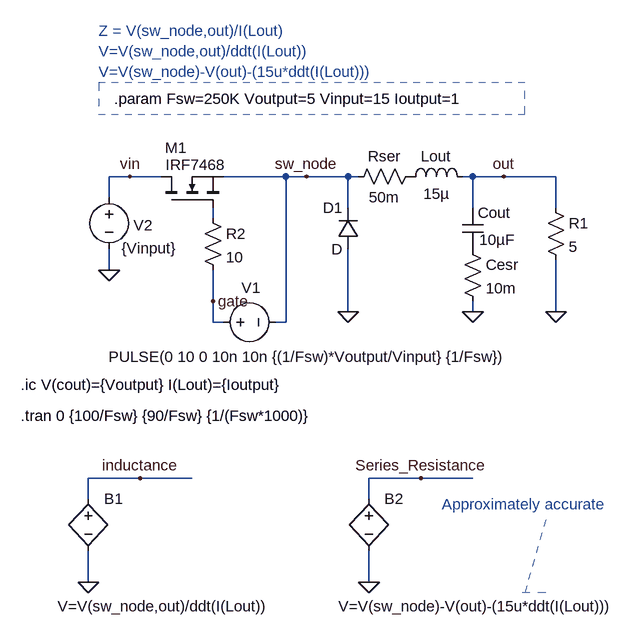
[diagram p0: schematic 03-inductance_volt_div_current.asc]
03-inductance_volt_div_current.asc, the LTspice schematic file:
Version 4
SHEET 1 1132 1048
WIRE -240 48 -272 48
WIRE -192 48 -240 48
WIRE 0 48 -96 48
WIRE 32 48 0 48
WIRE 96 48 32 48
WIRE 112 48 96 48
WIRE 288 48 272 48
WIRE 336 48 288 48
WIRE 416 48 336 48
WIRE -272 80 -272 48
WIRE 96 96 96 48
WIRE 288 96 288 48
WIRE 416 96 416 48
WIRE -112 112 -112 96
WIRE -272 192 -272 160
WIRE -112 240 -112 192
WIRE 96 256 96 160
WIRE 288 256 288 240
WIRE 416 256 416 176
WIRE -112 272 -112 240
WIRE -96 272 -112 272
WIRE 0 272 0 48
WIRE 0 272 -16 272
WIRE -224 512 -304 512
WIRE -144 512 -224 512
WIRE 208 512 128 512
WIRE 288 512 208 512
WIRE -304 544 -304 512
WIRE 128 544 128 512
WIRE -304 672 -304 624
WIRE 128 672 128 624
FLAG 96 256 0
FLAG 288 256 0
FLAG 416 256 0
FLAG 32 48 sw_node
FLAG -112 240 gate
FLAG -272 192 0
FLAG -240 48 vin
FLAG 336 48 out
FLAG -304 672 0
FLAG -224 512 inductance
FLAG 128 672 0
FLAG 208 512 Series_Resistance
SYMBOL ind 176 64 R270
WINDOW 0 32 56 VTop 2
WINDOW 3 5 56 VBottom 2
SYMATTR InstName Lout
SYMATTR Value 15µ
SYMBOL diode 112 160 R180
WINDOW 0 24 64 Left 2
WINDOW 3 24 0 Left 2
SYMATTR InstName D1
SYMBOL cap 272 96 R0
WINDOW 3 26 49 Left 2
SYMATTR Value 10µF
SYMATTR InstName Cout
SYMBOL res 272 144 R0
SYMATTR InstName Cesr
SYMATTR Value 10m
SYMBOL res 400 80 R0
SYMATTR InstName R1
SYMATTR Value 5
SYMBOL voltage -112 272 R270
WINDOW 0 53 44 VRight 2
WINDOW 3 -53 -161 VRight 2
WINDOW 123 0 0 Left 0
WINDOW 39 0 0 Left 0
SYMATTR InstName V1
SYMATTR Value PULSE(0 10 0 10n 10n {(1/Fsw)*Voutput/Vinput} {1/Fsw})
SYMBOL res -128 96 R0
SYMATTR InstName R2
SYMATTR Value 10
SYMBOL voltage -272 64 R0
WINDOW 123 21 95 Left 2
WINDOW 39 0 0 Left 0
WINDOW 0 38 59 Left 2
WINDOW 3 19 94 Left 2
SYMATTR InstName V2
SYMATTR Value {Vinput}
SYMBOL nmos -192 96 R270
WINDOW 0 92 6 VRight 2
WINDOW 3 66 7 VRight 2
SYMATTR InstName M1
SYMATTR Value IRF7468
SYMBOL res 208 32 R90
WINDOW 0 0 56 VBottom 2
WINDOW 3 32 56 VTop 2
SYMATTR InstName Rser
SYMATTR Value 50m
SYMBOL bv -304 528 R0
WINDOW 3 -47 181 Left 2
SYMATTR InstName B1
SYMATTR Value V=V(sw_node,out)/ddt(I(Lout))
SYMBOL bv 128 528 R0
WINDOW 3 -47 181 Left 2
SYMATTR InstName B2
SYMATTR Value V=V(sw_node)-V(out)-(15u*ddt(I(Lout)))
TEXT -264 -72 Left 2 !.param Fsw=250K Voutput=5 Vinput=15 Ioutput=1
TEXT -408 368 Left 2 !.ic V(cout)={Voutput} I(Lout)={Ioutput}
TEXT -408 416 Left 2 !.tran 0 {100/Fsw} {90/Fsw} {1/(Fsw*1000)}
TEXT -288 -176 Left 2 ;Z = V(sw_node,out)/I(Lout)\nV=V(sw_node,out)/ddt(I(Lout))\nV=V(sw_node)-V(out)-(15u*ddt(I(Lout)))
TEXT 240 552 Left 2 ;Approximately accurate
LINE Normal 400 688 352 688 2
LINE Normal 400 576 368 688 2
RECTANGLE Normal -288 -48 368 -96 2

The netlist it stands for:
* 03-inductance_volt_div_current.asc
Lout P001 out 15µ
D1 0 sw_node D
Cout out P002 10µF
R§Cesr P002 0 10m
R1 out 0 5
V1 gate sw_node PULSE(0 10 0 10n 10n {(1/Fsw)*Voutput/Vinput} {1/Fsw})
R2 N001 gate 10
V2 vin 0 {Vinput}
M1 vin N001 sw_node sw_node IRF7468
Rser P001 sw_node 50m
B1 inductance 0 V=V(sw_node,out)/ddt(I(Lout))
B2 Series_Resistance 0 V=V(sw_node)-V(out)-(15u*ddt(I(Lout)))
.model D D
.lib standard.dio
.model NMOS NMOS
.model PMOS PMOS
.lib standard.mos
.param Fsw=250K Voutput=5 Vinput=15 Ioutput=1
.ic V(cout)={Voutput} I(Lout)={Ioutput}
.tran 0 {100/Fsw} {90/Fsw} {1/(Fsw*1000)}
* Z = V(sw_node,out)/I(Lout)
* V=V(sw_node,out)/ddt(I(Lout))
* V=V(sw_node)-V(out)-(15u*ddt(I(Lout)))
* Approximately accurate
.backanno
.end

* Results of the author's LTspice run, read from the files saved beside the schematic
* Operating Point, zero values left out:
*   V(inductance) = nan V
*   Id(M1) = 61.73 pA
*   Is(M1) = -61.73 pA
*   I(D1) = 999.9 mA
*   I(Lout) = 999.9 mA
*   I(R1) = 999.9 mA
*   I(Rser) = -999.9 mA
*   I(V2) = -77.31 pA
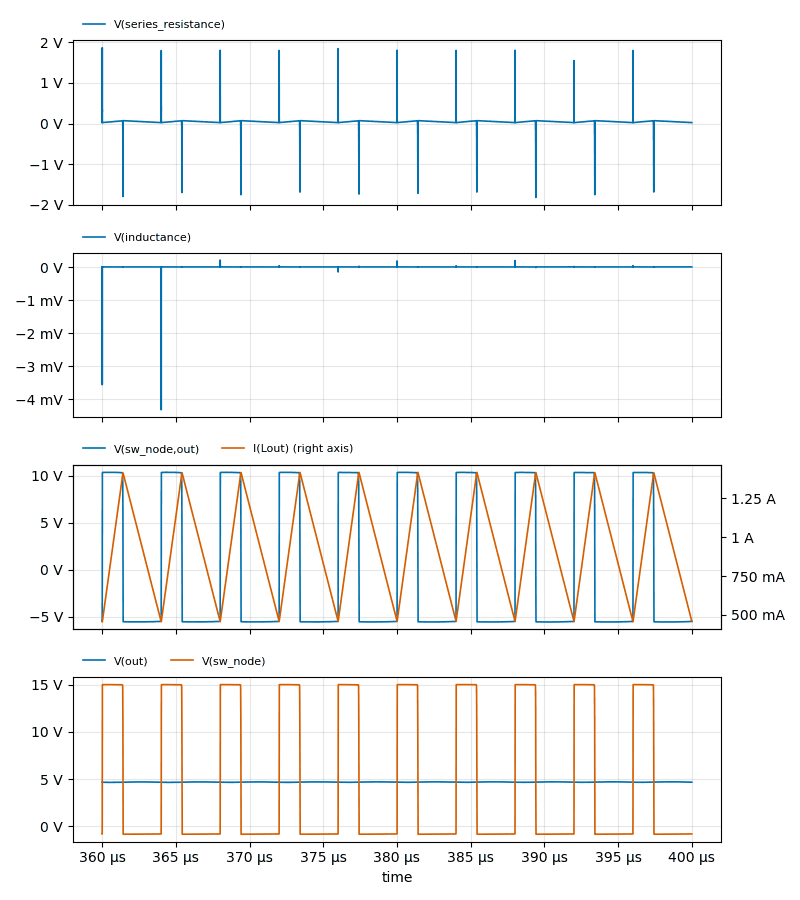
[diagram p1: Transient Analysis of 03-inductance_volt_div_current.asc, plotted from the saved traces]
* Transient Analysis, 1 run:
*   V(series_resistance): min -1.824 V, max 1.867 V, average 42.23 mV, rms 113.3 mV, last 23.03 mV
*   V(inductance): min -4.313 mV, max 221.6 µV, average 14.56 µV, rms 37.88 µV, last 14.94 µV
*   V(sw_node,out): min -5.535 V, max 10.35 V, average 47.4 mV, rms 7.545 V, last -5.479 V
*   I(Lout): min 454 mA, max 1.418 A, average 937.3 mA, rms 978.6 mA, last 459.1 mA
*   V(out): min 4.643 V, max 4.701 V, average 4.675 V, rms 4.675 V, last 4.665 V
*   V(sw_node): min -845.2 mV, max 14.99 V, average 4.722 V, rms 8.888 V, last -813.7 mV